# Altium schematic sheet KRAC.SchDoc
size 420 x 297 mm; CheckedBy: Журавлёв; Author: Томашевич; CompanyName: Каф.  ТОЭ, гр. 721901; Address1: Address1; Address2: Address2; Address3: Address3; Address4: Address4; DocumentNumber: ГУИР.721901.023 Э3; SheetTotal: 1; Scale: 1:1; Title2str: DC-DC Преобразователь; DocumentType: понижающего типа; FirstReferrence: ГУИР.721901.023
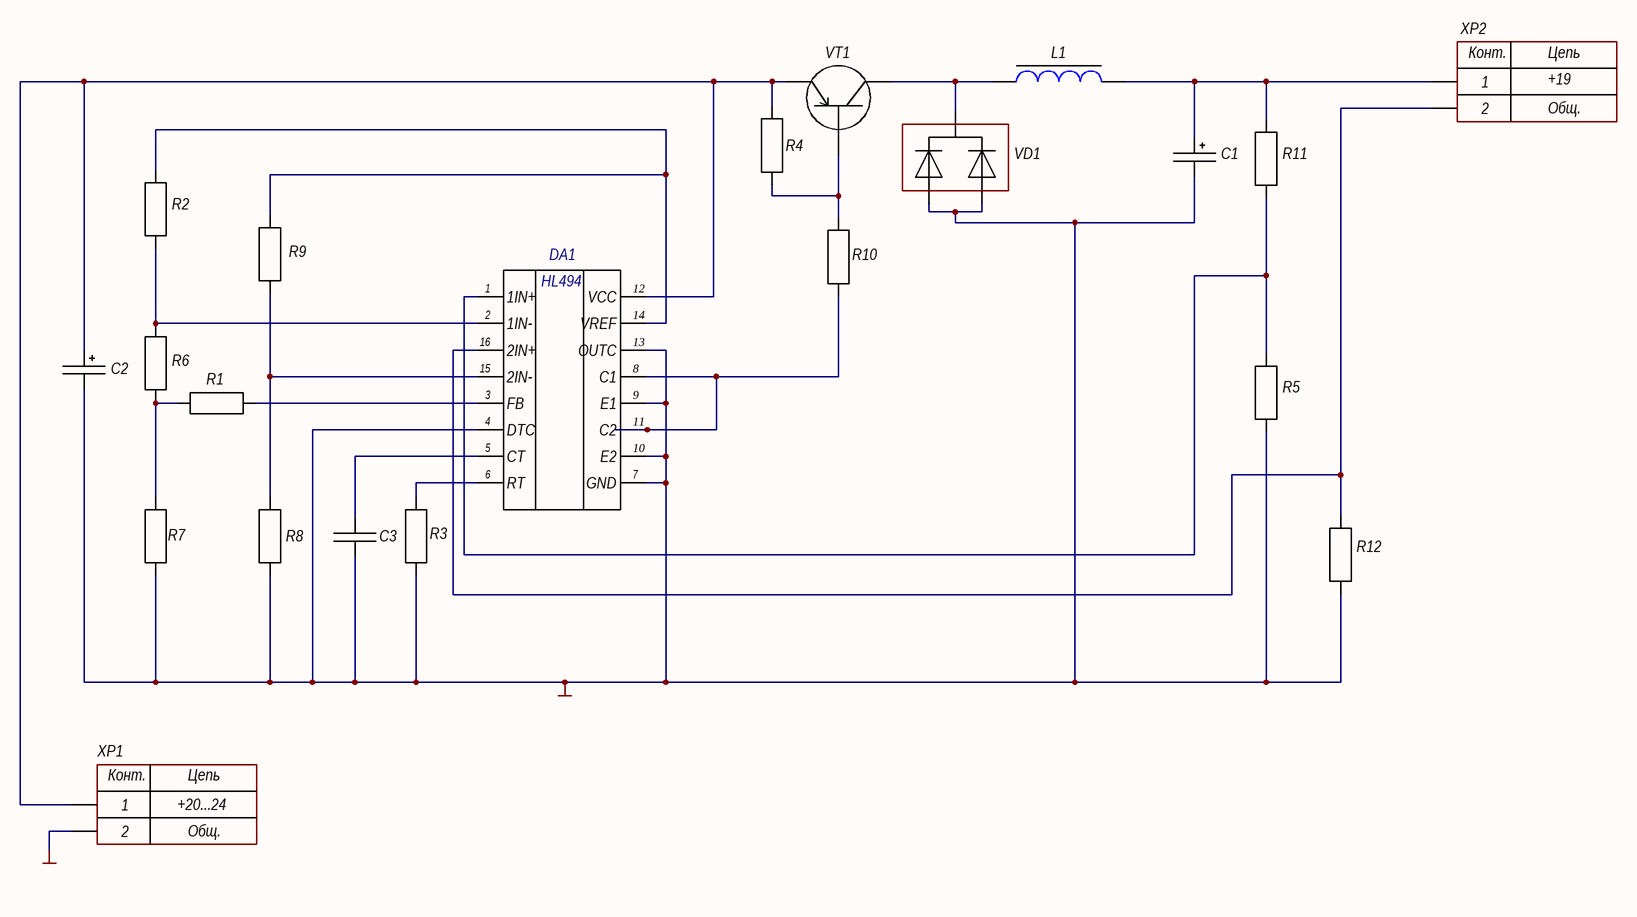
[diagram p0: KRAC.SchDoc]

## Parts
*?  DA1
?  VD1
C1  (no value)  [CAP: TANTAL-A]
C2  (no value)  [CAP: TANTAL-A]
C3  (no value)  [CAP: ECHU(X) D (2416)]
L1  (no value)  [IND: 0201]
R1  *  [R1206]  (value not drawn)
R2  *  [R1206]  (value not drawn)
R3  *  [R1206]  (value not drawn)
R4  *  [R1206]  (value not drawn)
R5  *  [R1206]  (value not drawn)
R6  *  [R1206]  (value not drawn)
R7  *  [R1206]  (value not drawn)
R8  *  [R1206]  (value not drawn)
R9  *  [R1206]  (value not drawn)
R10  *  [R1206]  (value not drawn)
R11  *  [R1206]  (value not drawn)
R12  *  [R1206]  (value not drawn)
VT1  (no value)  [D2PAK]
XP1  (no value)  [CON: 6PCV-02-006]
XP2  (no value)  [CON: 6PCV-02-006]

## Nets
GND: *?.4(DTC) *?.7(GND) *?.9(E1) *?.10(E2) *?.13(OUTC) ?.1 ?.2 C1.2 C2.2 C3.2 R3.1 R5.1 R7.1 R8.1 R12.1 XP1.2
Net*?_1: *?.1(1IN+) R5.2 R11.1
Net*?_2: *?.2(1IN-) R2.2 R6.2
Net*?_3: *?.3(FB) R1.1
Net*?_5: *?.5(CT) C3.1
Net*?_6: *?.6(RT) R3.2
Net*?_8: *?.8(C1) *?.11(C2) R10.1
Net*?_12: *?.12(VCC) C2.1 R4.2 VT1.2 XP1.1
Net*?_14: *?.14(VREF) R2.1 R9.2
Net*?_15: *?.15(2IN-) R8.2 R9.1
Net*?_16: *?.16(2IN+) R12.2 XP2.2
Net?_3: ?.3 L1.2 VT1.3
NetC1_1: C1.1 L1.1 R11.2 XP2.1
NetR1_2: R1.2 R6.1 R7.2
NetR4_1: R4.1 R10.2 VT1.1

## Notes on the sheet
- +19
- +20...24
- Перв. примен.
- Справ. №
- Подп. и дата
- Инв. № дубл.
- Взам. инв. №
- Разраб.
- Изм.
- Лист
- № докум.
- Подп.
- Дата
- Лит.
- Масса
- Масштаб
- Пров.
- Т.контр.
- Листов
- Инв. № подл.
- Утв.
- Н.контр.
- 2.106-A3
- Копировал
- Формат А3
- (in symbol Connector_6PCV-02) Конт.; Цепь; Общ.

## Library data of the parts
*? = HL494
? = DIOD_ARRAY_MBR20100CT
C1 C2 = Tantal_A: Manufacturer: AVX; PartNumber: F930J107KAAAJ6; ValueManufacturerPartNumber: Tantalum capacitor, 100μF, 6.3V, ±10%, 2Ohm, case A (3216), -55...+125°C; Impedance: 2Ohm; Tolerance: ±10%; TypeDielectric: X7R; TypeCapacitor: Tantalum capacitor; Voltage: 6.3V; Value: 100μF; Package: case A (3216); HelpURL: https://www.digikey.com/product-detail/en/avx-corporation/F930J107KAAAJ6/478-12404-1-ND/9645231; Temperature: -55...+125°C
C3 = Film_SMD: Manufacturer: Panasonic Electronic Components; PartNumber: ECH-U1H104JX9; ValueManufacturerPartNumber: Film capacitor, 0.1µF, 50VDC, ±5%, *, 1913, -55...+125°C; TypeCapacitor: Film capacitor; Tolerance: ±5%; Voltage: 50VDC; Value: 0.1µF; Package: 1913; HelpURL: https://www.digikey.com/product-detail/en/panasonic-electronic-components/ECH-U1H104JX9/PCF1561CT-ND/1630924; Temperature: -55...+125°C; Impedance: *
L1 = Inductor_0201: Manufacturer: Murata Electronics; PartNumber: LQP03TNR10J02D; ValueManufacturerPartNumber: Fixed inductor, 100nH, ±5%, 0201, 80mA, -55...+125°C; TypeInductor: Fixed inductor; MaxCurrent: 80mA; Tolerance: ±5%; Value: 100nH; Package: 0201; HelpURL: https://www.digikey.com/product-detail/en/murata-electronics-north-america/LQP03TNR10J02D/490-6742-1-ND/3845939; Temperature: -55...+125°C
R1-R12 = MyResistor: Model: *; Manufacture: *; Case: *; Help URL: *; Value: *
VT1 = BJT_PNP_123: Manufacturer: ON Semiconductor; ValueManufacturerPartNumber: PNP transistor, 45V, 100mA, 100MHz, 300mW, 0.65V, 220, SOT-23, -55...+125°C; PartNumber: BC857BLT3G; TypeTransistor: PNP transistor; VoltageCE: 45V; CurrentCE: 100mA; VoltageSaturation: 0.65V; Frequency: 100MHz; CurrentGain: 220; MaxPower: 300mW; Package: SOT-23; HelpURL: https://www.digikey.com/product-detail/en/on-semiconductor/BC857BLT3G/BC857BLT3GOSCT-ND/2704963; Temperature: -55...+125°C
XP1 XP2 = Connector_6PCV-02: Manufacturer: TE Connectivity; ValueManufacturerPartNumber: Connector, 2pin, 9.53mm, 300VAC, 25A; PartNumber: 6PCV-02-006; VoltageMax: 300VAC; Pitch: 9.53mm; CurrentMax: 25A; Multichannel: 2pin; HelpURL: https://www.digikey.com/products/en?keywords=6PCV-02-006; TypeConnector: Connector